# EAGLE design motion_detect (EAGLE 7.7.0)
Assembly variants: AM612, AM312
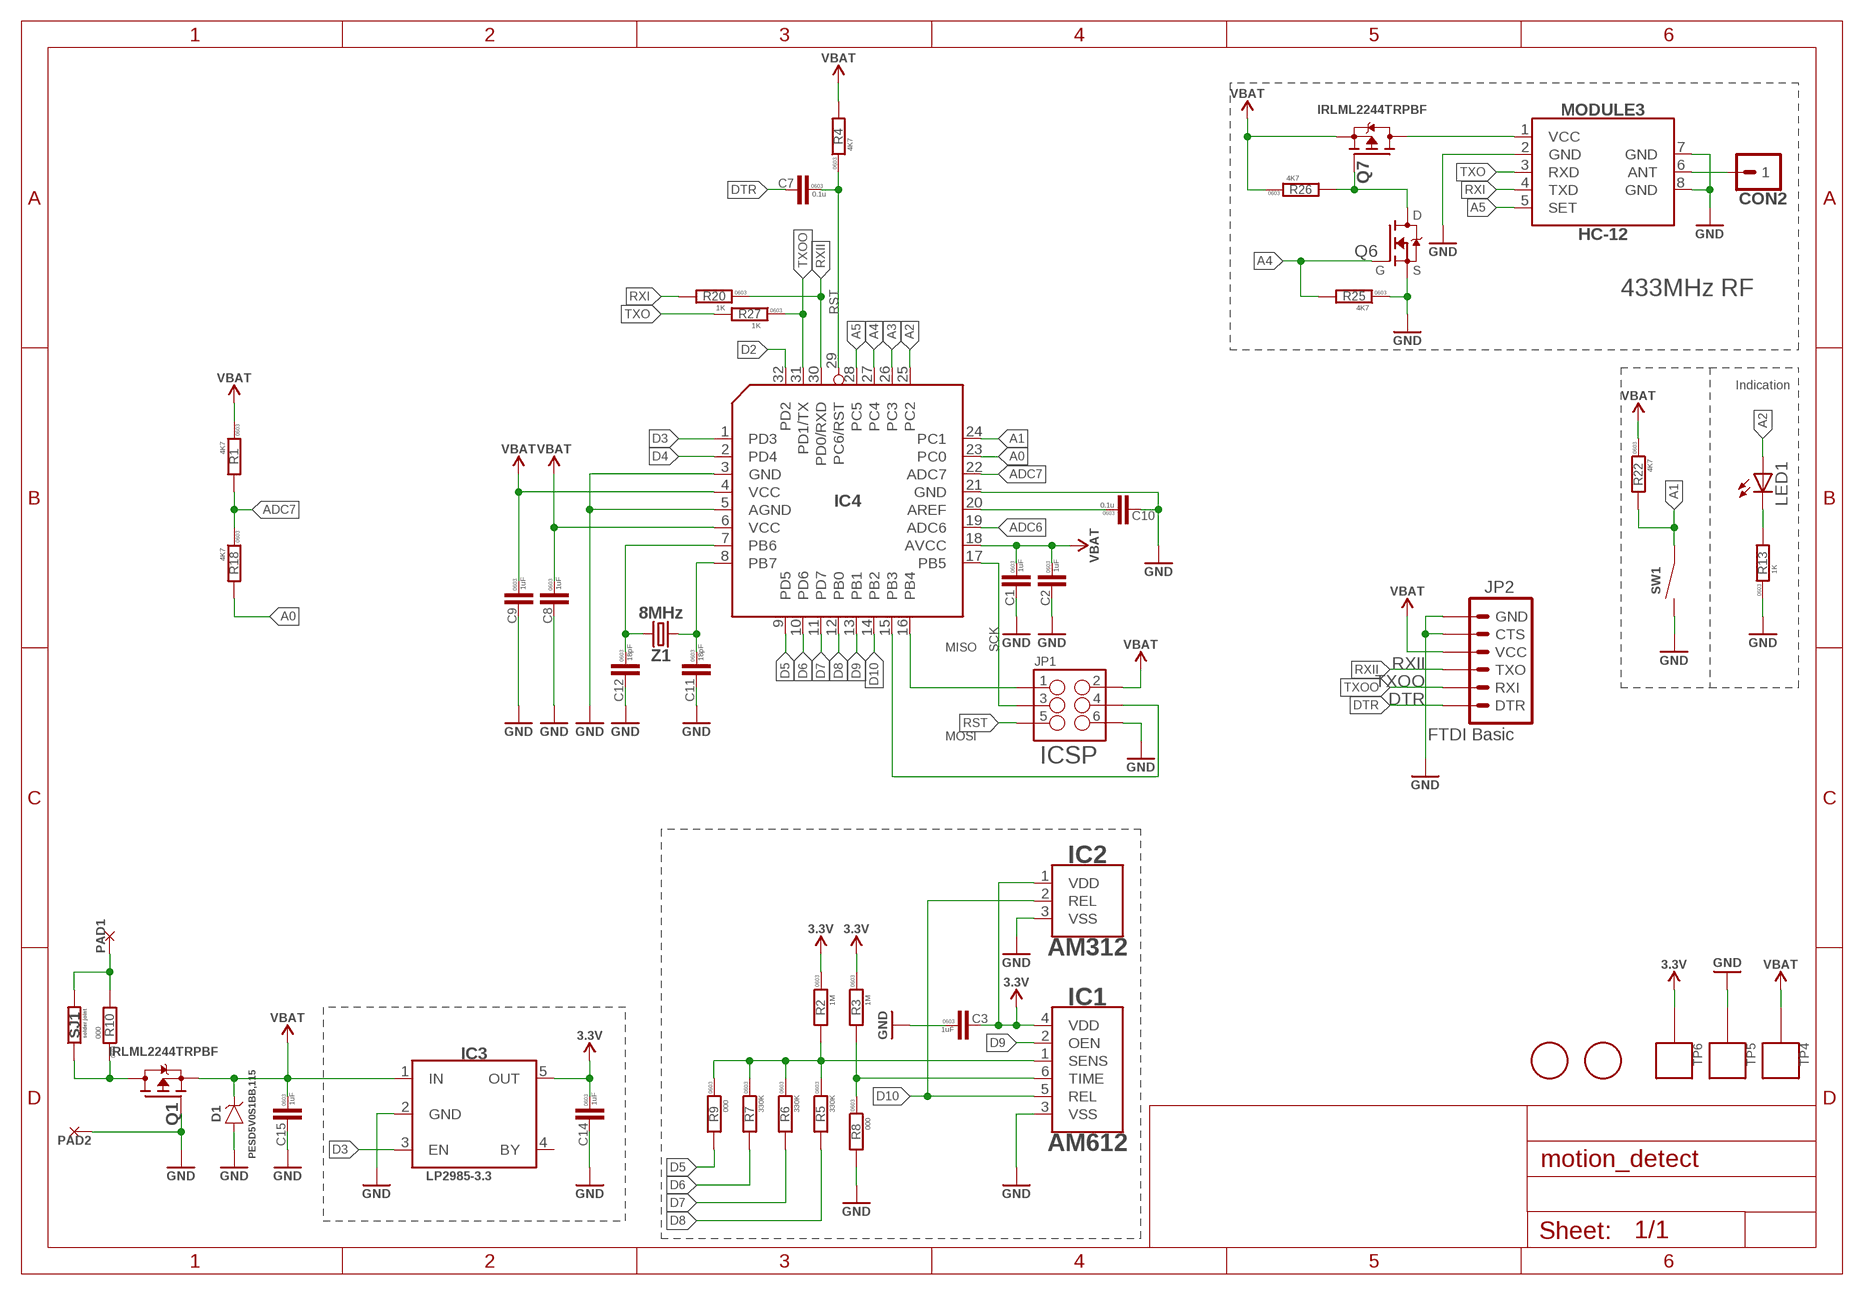
[diagram p0: schematic, sheet 1]

## Parts
C1  1uF  C-0603  [C0603]
C2  1uF  C-0603  [C0603]
C3  1uF  C-0603  [C0603]
C7  0.1u  C-0603  [C0603]
C8  1uF  C-0603  [C0603]
C9  1uF  C-0603  [C0603]
C10  0.1u  C-0603  [C0603]
C11  18pF  C-0603  [C0603]
C12  18pF  C-0603  [C0603]
C14  1uF  C-0603  [C0603]
C15  1uF  C-0603  [C0603]
CON2  PINHEAD_1X01-2.54  [1X01-PTH-2.54]
D1  PESD5V0S1BB,115  [SOD123]
IC1  AM612  [AM612]  (not fitted in variant AM312)
IC2  AM312  [AM312_SIL]  (not fitted in variant AM612)
IC3  3.3  LP2985-3.3V  [SOT23-5L]
IC4  ATMEGA168-TQFP32  [TQFP32-08]
JP1  M03X2POGO_PINS  [2X3_POGO]
JP2  FTDI Basic  ARDUINO_SERIAL_PROGRAMPTH  [1X06]
LED1  LED-3MM  [LED-3MM]
MODULE3  HC12  [HC-12]
PAD1  PAD-4X3  [4X3]
PAD2  PAD-4X3  [4X3]
Q1  IRLML2244TRPBF  [SOT23B-3]
Q6  IRLML2502-SOT23  [SOT23B-3]
Q7  IRLML2244TRPBF  [SOT23B-3]
R1  4K7  R-0603  [R0603]
R2  1M  R-0603  [R0603]
R3  1M  R-0603  [R0603]
R4  4K7  R-0603  [R0603]
R5  330K  R-0603  [R0603]
R6  330K  R-0603  [R0603]
R7  330K  R-0603  [R0603]
R8  000  R-0603  [R0603]
R9  000  R-0603  [R0603]
R10  000  R-0603  [R0603]
R13  1K  R-0603  [R0603]
R18  4K7  R-0603  [R0603]
R20  1K  R-0603  [R0603]
R22  4K7  R-0603  [R0603]
R25  4K7  R-0603  [R0603]
R26  4K7  R-0603  [R0603]
R27  1K  R-0603  [R0603]
SJ1  SOLDER_JOINT_2P  [SJ_2P]
SW1  TACT_SWITCH-IT-1102S  [IT-1102S]
TP4  PAD.05  [PAD.05X.05]  (not fitted in variant AM612)  (not fitted in variant AM312)
TP5  PAD.05  [PAD.05X.05]  (not fitted in variant AM612)  (not fitted in variant AM312)
TP6  PAD.05  [PAD.05X.05]  (not fitted in variant AM612)  (not fitted in variant AM312)
U$4  FIDUCIALMOUNT  [FIDUCIA-MOUNT]  (not fitted in variant AM612)  (not fitted in variant AM312)
U$6  FIDUCIALMOUNT  [FIDUCIA-MOUNT]  (not fitted in variant AM612)  (not fitted in variant AM312)
Z1  8MHz  CRYSTAL-8MHZHC49UP  [HC49UP]

## Nets
A0: IC4.23(PC0) R18.2
A1: IC4.24(PC1) R22.2 SW1.1 SW1.2
A2: IC4.25(PC2) LED1.A
A3: IC4.26(PC3)
A4: IC4.27(PC4) Q6.1(G) R25.2
A5: IC4.28(PC5) MODULE3.5(SET)
ADC6: IC4.19(ADC6)
ADC7: IC4.22(ADC7) R1.2 R18.1
ANT: CON2.1 MODULE3.6(ANT)
D2: IC4.32(PD2)
D3: IC3.3(EN) IC4.1(PD3)
D4: IC4.2(PD4)
D5: IC4.9(PD5) R9.2
D6: IC4.10(PD6) R7.2
D7: IC4.11(PD7) R6.2
D8: IC4.12(PB0) R5.2
D9: IC1.2(OEN) IC4.13(PB1)
D10: IC1.5(REL) IC2.2(REL) IC4.14(PB2)
DTR: C7.2 JP2.1(DTR)
GND: C1.2 C2.2 C3.1 C8.2 C9.2 C10.2 C11.2 C12.2 C14.2 C15.2 D1.A IC1.3(VSS) IC2.3(VSS) IC3.2(GND) IC4.3(GND) IC4.5(AGND) IC4.21(GND) JP1.P$6 JP2.5(CTS) JP2.6(GND) MODULE3.2(GND) MODULE3.7(GND) MODULE3.8(GND) PAD2.P$1 Q1.1(G) Q6.2(S) R8.2 R13.1 R25.1 SW1.3 SW1.4 TP5.P$1
MISO: IC4.16(PB4) JP1.P$1
MOSI: IC4.15(PB3) JP1.P$4
N$1: PAD1.P$1 R10.2 SJ1.2
N$3: IC1.6(TIME) R3.2 R8.1
N$4: C10.1 IC4.20(AREF)
N$5: IC1.1(SENS) R2.2 R5.1 R6.1 R7.1 R9.1
N$6: C12.1 IC4.7(PB6) Z1.2
N$7: Q1.3(D) R10.1 SJ1.1
N$8: C11.1 IC4.8(PB7) Z1.1
N$12: LED1.K(C) R13.2
N$24: MODULE3.1(VCC) Q7.3(D)
N$27: Q6.3(D) Q7.1(G) R26.2
RST: C7.1 IC4.29(PC6/RST) JP1.P$5 R4.1
RXI: MODULE3.4(TXD) R20.2
RXII: IC4.30(PD0/RXD) JP2.3(TXO) R20.1
SCK: IC4.17(PB5) JP1.P$3
TXO: MODULE3.3(RXD) R27.2
TXOO: IC4.31(PD1/TX) JP2.2(RXI) R27.1
VBAT: C1.1 C2.1 C8.1 C9.1 C15.1 D1.C IC3.1(IN) IC4.4(VCC) IC4.6(VCC) IC4.18(AVCC) JP1.P$2 JP2.4(VCC) Q1.2(S) Q7.2(S) R1.1 R4.2 R22.1 R26.1 TP4.P$1
VDD_3V3: C3.2 C14.1 IC1.4(VDD) IC2.1(VDD) IC3.5(OUT) R2.1 R3.1 TP6.P$1 ; supply symbol labelled 3.3V
Unconnected: IC3.4(BY)

## Notes on the sheet
- 433MHz RF
- Indication
- ICSP

## Library data of the parts
C1-C3 C7-C12 C14 C15 = rc:C; PACKAGE: 0603
CON2 = pinhead:PINHEAD_1X01: pinheader 1P; BOM: EXCLUDE
D1 = TVS_diodes:PESD5V0S1BB,115; DIGIKEY#: 1727-3838-2-ND; MANF: Nexperia USA Inc; MANF#: PESD5V0S1BB,115
IC1 = motion_detect_masterlib:AM612
IC2 = motion_detect_masterlib:AM312
IC3 = motion_detect_masterlib:LP2985-3.3V: IC REG LDO 3.3V 0.15A SOT23-5; DIGIKEY#: 296-18476-1-ND; MANF: Texas Instruments; MANF#: LP2985-33DBVR
IC4 = motion_detect_masterlib:ATMEGA168; MANF#: ATMEGA168
JP1 = SparkFun-Connectors:M03X2: 2x3 .1" header. Shrouded, with keying- CONN-10681 SMT- CONN-11415 Pogo pins- HW-11044; PROD_ID: HW-11044
JP2 = SparkFun:ARDUINO_SERIAL_PROGRAM
LED1 = dp_devices:LED: Light Emitting Diode; COLOR: RED
MODULE3 = motion_detect_masterlib:HC12
PAD1 PAD2 = PADS:PAD; BOM: EXCLUDE
Q1 Q7 = motion_detect_masterlib:IRLML2244TRPBF: MOSFET P-CH 20V 4.3A SOT23; DIGIKEY#: IRLML2244TRPBFCT-ND; LINK: https://www.chipdip.ru/product/irlml2244trpbf; MANF: Infineon Technologies; MANF#: IRLML2244TRPBF
Q6 = motion_detect_masterlib:IRLML2502: MOSFET N-CH 20V 4.2A SOT-23; DIGIKEY#: IRLML2502PBFTR-ND; MANF: Infineon Technologies; MANF#: IRLML2502TRPBF
R1-R10 R13 R18 R20 R22 R25-R27 = rc:R; PACKAGE: 0603
SJ1 = misc:SOLDER_JOINT_2P; BOM: EXCLUDE
SW1 = motion_detect_masterlib:TACT_SWITCH; LINK: https://www.chipdip.ru/product/kls7-ts6604-4.3-180-b-it-1102s
TP4-TP6 = pixhawk2:PAD: Test pad This footprint includes three classes: The actual test pads, a pogo-pin footprint to mount the pogo-pin as through-hole part and a hole footprint which allows the head of the pogo-pin to pass through (do NOT use the hole to mount the pogo-pin). In a typical test setup, the stack would consist of three PCBs: The actual PCB under testing with a test pad on the bottom, then a second PCB with the hole for the pogo-pin head where the PCB under testing is pressed on and a third PCB at 30 mm / 1.2" distance with the pogo-pin footprints. The pogo-pins are soldered to the last PCB. To create the stack, copy the board under testing and exchange the footprints - this way the correct positioning is ensured.; BOM: EXCLUDE; PARTNO: *
U$4 U$6 = eth_conv_master_lib:FIDUCIALMOUNT; BOM: EXCLUDE
Z1 = ExitControl_v2_master_library:CRYSTAL-8MHZ: Crystal 8.0000MHz 30ppm 18pF 40 Ohm -20°C - 70°C Surface Mount HC49/US; DIGIKEY#: 535-10212-1-ND; MANF: Abracon LLC; MANF#: ABLS-8.000MHZ-B4-T

## Net classes
0 default: width 0.2 mm
1 vcc: width 0.254 mm

## Board
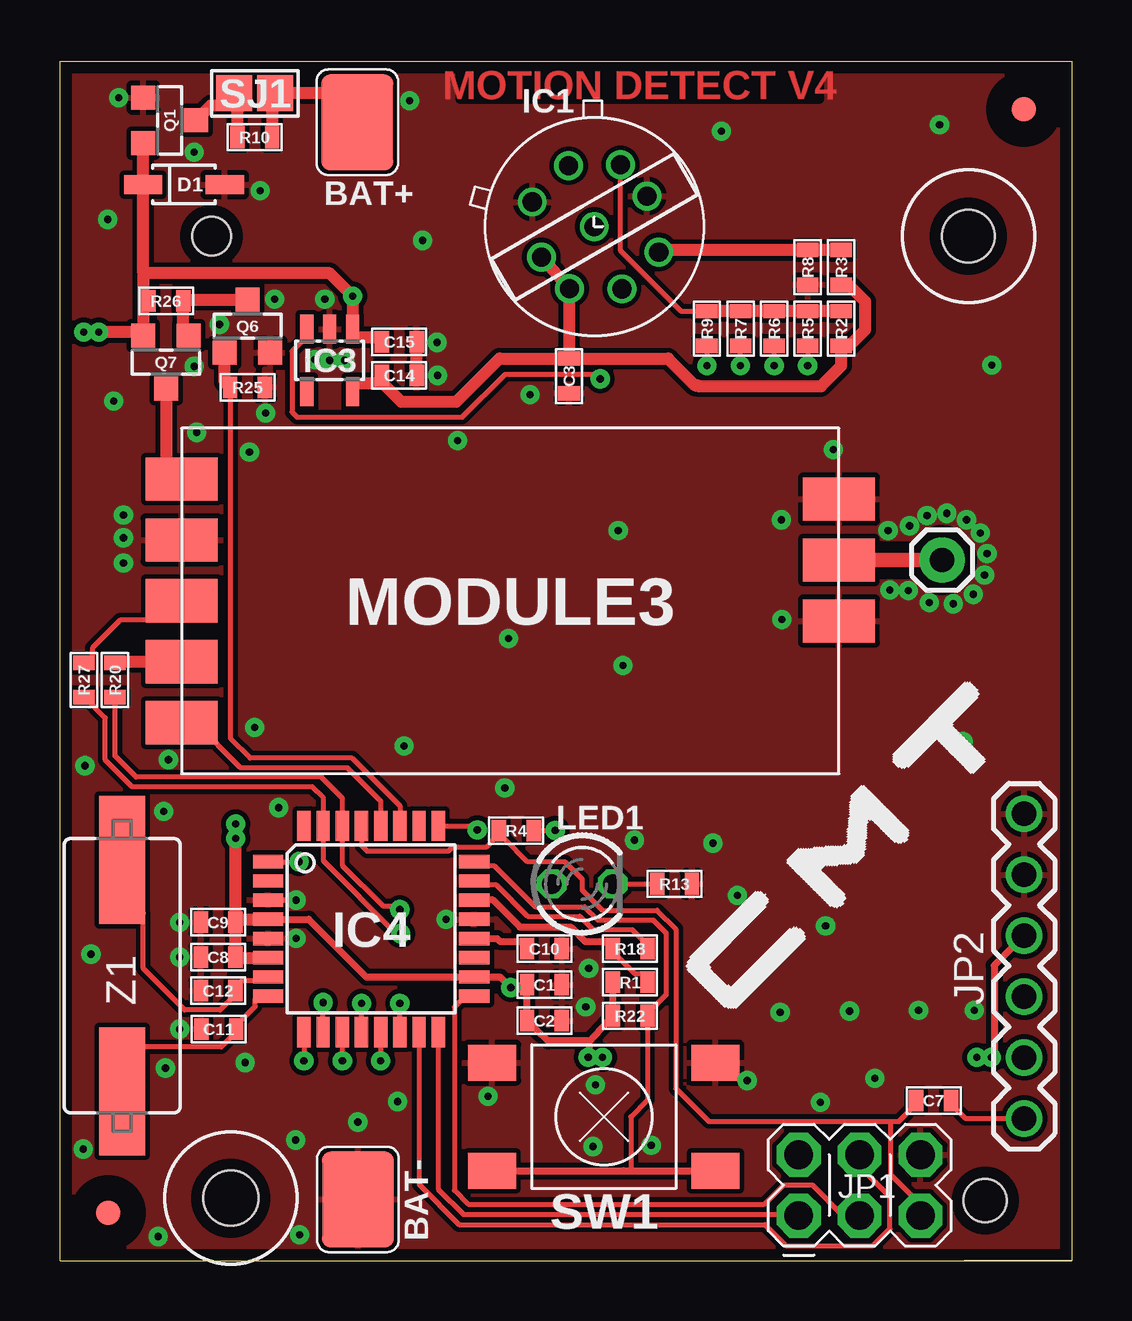
[diagram p1: board, top side]
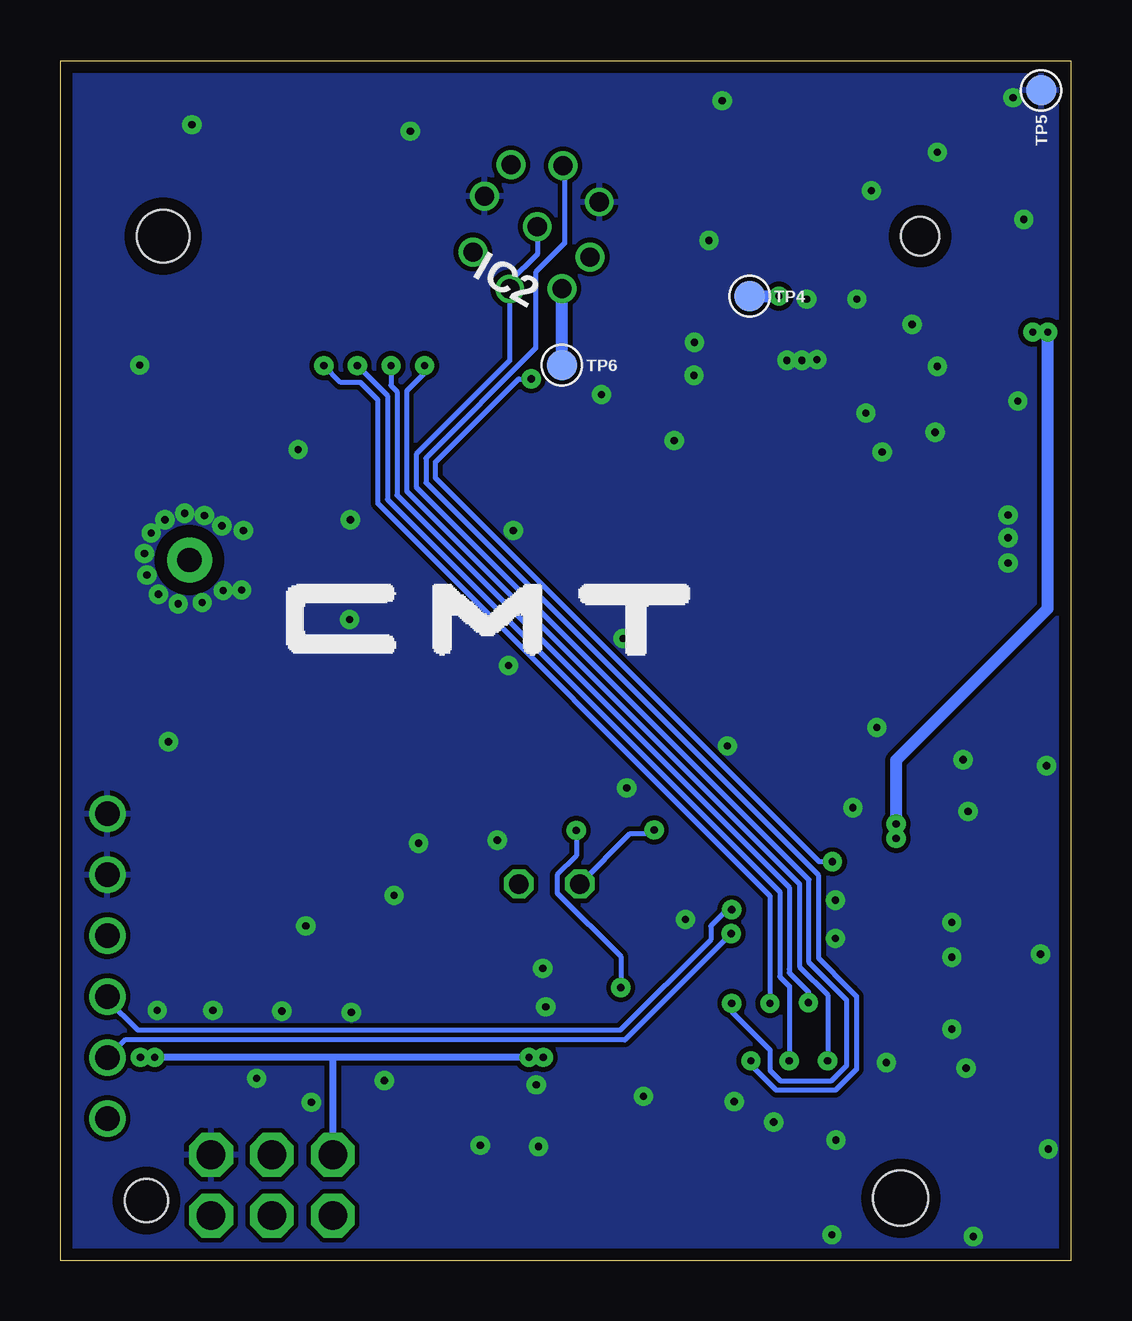
[diagram p2: board, bottom side, seen from below]

Size 42.15 x 50 mm. Coordinates in mm from the lower left corner, seen from the top.
Copper layers (1*2*15*16): Top 0.035mm / dielectric 0.5mm / Route2 0.035mm / dielectric 0.5mm / Route15 0.035mm / dielectric 0.5mm / Bottom 0.035mm
Design rules "RTK_design_rules *": minimum track width 0.15mm, minimum drill 0.2mm, track to track 0.2mm, track to pad 0.2mm, pad to pad 0.2mm, via to via 0.2mm, smd to smd 0.15mm, copper to edge 0.5mm, drill to drill 0.2mm, minimum pad ring 0.125mm, minimum via ring 0.125mm, stop-mask expansion 1mil, vias tented up to drill 0.31mm, thermal gap 8mil
tRestrict: area 35.5,28 to 38,30.4; 2 lines
bRestrict: area 35.5,28 to 38,30.4

### Footprints (pad centres in the part's own frame; a part is rotated, then mirrored left to right if it is on the bottom)
C0603 = smd 0.6 x 0.9: 1 -0.725,0; 2 0.725,0
1X01-PTH-2.54 = drill 1.016 pad 1.88: 1 0,0
SOD123 = smd 1.6 x 0.8: A -1.7,0; C 1.7,0
AM612 = drill 0.8: 1 1.05,2.6; 2 2.55,1.04; 3 2.55,-1.1; 4 -1.1,-2.55; 5 -2.65,-1.02; 6 -2.65,1.15
AM312_SIL = drill 0.8: 1 2.54,0; 2 0,0; 3 -2.54,0
SOT23-5L = smd 0.55 x 1.2: 1 -0.95,-1.3; 2 0,-1.3; 3 0.95,-1.3; 4 0.95,1.3; 5 -0.95,1.3
TQFP32-08 = smd 1.27 x 0.559: 1 -4.293,2.8; 2 -4.293,2; 3 -4.293,1.2; 4 -4.293,0.4; 5 -4.293,-0.4; 6 -4.293,-1.2; 7 -4.293,-2; 8 -4.293,-2.8; 17 4.293,-2.8; 18 4.293,-2; 19 4.293,-1.2; 20 4.293,-0.4; 21 4.293,0.4; 22 4.293,1.2; 23 4.293,2; 24 4.293,2.8 | smd 0.559 x 1.27: 9 -2.8,-4.293; 10 -2,-4.293; 11 -1.2,-4.293; 12 -0.4,-4.293; 13 0.4,-4.293; 14 1.2,-4.293; 15 2,-4.293; 16 2.8,-4.293; 25 2.8,4.293; 26 2,4.293; 27 1.2,4.293; 28 0.4,4.293; 29 -0.4,4.293; 30 -1.2,4.293; 31 -2,4.293; 32 -2.8,4.293
2X3_POGO = drill 1.2 pad 1.829 octagon: P$1 0,0; P$2 0,2.54; P$3 2.54,0; P$4 2.54,2.54; P$5 5.08,0; P$6 5.08,2.54
1X06 = drill 1.016: 1 0,0; 2 2.54,0; 3 5.08,0; 4 7.62,0; 5 10.16,0; 6 12.7,0
LED-3MM = drill 0.813 octagon: A -1.27,0; K 1.27,0
HC-12 = smd 3 x 1.8: 1 -13.7,5.08; 2 -13.7,2.54; 3 -13.7,0; 4 -13.7,-2.54; 5 -13.7,-5.08; 6 13.7,1.7; 7 13.7,4.24; 8 13.7,-0.84
4X3 = smd 4 x 3: P$1 0,0
SOT23B-3 = smd 1 x 1: 1 -0.95,-1.1; 2 0.95,-1.1; 3 0,1.1
R0603 = smd 0.6 x 0.9: 1 -0.725,0; 2 0.725,0
SJ_2P = smd 1.5 x 1.5: 1 -0.85,0; 2 0.85,0
IT-1102S = smd 2 x 1.5: 1 -4.65,2.25; 2 4.65,2.25; 3 -4.65,-2.25; 4 4.65,-2.25
PAD.05X.05 = smd 1.27 x 1.27: P$1 0,0
REDMOND_BOARD = hole 2.2: 37.85,42.7 | hole 2.3: 7.1,2.6 | hole 1.8: 38.55,2.5 | hole 1.6: 6.3,42.7
FIDUCIA-MOUNT = smd 1.016 x 1.016: P$1 0,0
HC49UP = smd 5.334 x 1.93: 1 -4.826,0; 2 4.826,0

### Placement (x,y rotation side)
C1  20.18,11.5 0 top
C2  20.18,10 0 top
C3  21.2,36.88 90 top
C7  36.4,6.67 0 top
C8  6.58,12.65 180 top
C9  6.58,14.1 180 top
C10  20.18,13 0 top
C11  6.6,9.65 180 top
C12  6.58,11.25 180 top
C14  14.12,36.9 0 top
C15  14.12,38.3 0 top
CON2  36.75,29.2 0 top
D1  5.15,44.85 180 top
IC1  22.25,43.1 45 bottom
IC2  22.25,43.1 330 bottom
IC3  11.22,37.52 180 top
IC4  12.95,13.82 0 top
JP1  30.77,1.88 0 top
JP2  40.17,5.92 90 top
LED1  21.75,15.7 0 top
MODULE3  18.75,27.5 0 top
PAD1  12.38,47.45 90 top
PAD2  12.4,2.55 90 top
Q1  4.55,47.52 270 top
Q6  7.8,38.95 0 top
Q7  4.4,37.45 180 top
R1  23.75,11.6 0 top
R2  32.55,38.85 90 top
R3  32.55,41.4 90 top
R4  19,17.93 0 top
R5  31.15,38.85 270 top
R6  29.75,38.85 270 top
R7  28.35,38.85 270 top
R8  31.15,41.4 270 top
R9  26.95,38.85 270 top
R10  8.1,46.83 0 top
R13  25.6,15.7 180 top
R18  23.75,13 0 top
R20  2.27,24.2 90 top
R22  23.75,10.2 0 top
R25  7.8,36.4 180 top
R26  4.4,40 0 top
R27  0.97,24.2 90 top
SJ1  8.1,48.65 0 top
SW1  22.65,6 180 top
TP4  13.4,40.2 0 bottom
TP5  1.25,48.77 270 bottom
TP6  21.23,37.33 0 bottom
U$1  [SMT_LOGO]  28,10.18 45 top
U$2  [REDMOND_BOARD]  0,0 0 top
U$3  [SMT_LOGO]  32.76,25.19 0 bottom
U$4  40.15,48 0 top
U$6  2,2 0 top
Z1  2.58,11.88 90 top

### Tracks (layer width: path | path; a pad name or v marks a point on that pad's centre or on a via)
A0
  Top 0.2: IC4.23 17.4,15.82 17.57,15.65 18.18,15.65 19.48,14.35 21.65,14.35 22.2,13.8 23.82,13.8 24.48,13.15 R18.2
A1
  Top 0.2: 23.48,3.75 23.48,3.7 | IC4.24 17.4,16.62 17.57,16.45 18.1,16.45 19.8,14.75 21.85,14.75 22.4,14.2 24.71,14.2 25.25,13.66 25.25,11.07 24.66,10.49 24.64,10.49 24.48,10.32 R22.2 24.48,6.7 23.77,6 23.77,3.75
  Top 0.3: 17.8,3.75 SW1.2 23.48,3.75 23.77,3.75 SW1.1 27.5,3.75
A2  (via drill 0.3 pad 0.8)
  Top 0.2: 15.75,17.85 IC4.25 17.38,18.12 v17.38,17.95
  Bottom 0.2: LED1.A 18.38,17.8 17.38,17.8 v17.38,17.95
A4
  Top 0.2: R25.2 7.1,36.4 7.1,21.75 7.9,20.95 12.15,20.95 14.15,18.95 IC4.27
  Top 0.5: R25.2 6.85,36.62 Q6.1
A5
  Top 0.2: MODULE3.5 5.63,22.42 7.5,20.55 11.95,20.55 13.35,19.15 IC4.28
ADC7
  Top 0.2: R18.1 23.02,12.88 23.95,11.95 24.27,11.95 24.48,11.75 R1.2
  Top 0.3: R18.1 23.02,13.15 23,13.15 22.85,13.3 21.88,13.3 21.27,13.9 19.15,13.9 18.02,15.03 IC4.22
ANT
  Top 0.6: MODULE3.6 CON2.1
D3  (via drill 0.3 pad 0.8)
  Top 0.2: IC4.1 v9.95,16.62 | IC3.3 10.28,38.52 9.65,37.9 9.65,35.38 9.88,35.15 16.75,35.15 18.55,36.95 22.3,36.95 v22.5,36.75
  Bottom 0.2: v9.95,16.62 10.5,16.62 26.5,32.62 26.5,33.28 23.03,36.75 v22.5,36.75
D5  (via drill 0.3 pad 0.8)
  Top 0.2: IC4.9 v10.15,8.32 | R9.2 v26.95,37.3
  Bottom 0.2: v26.95,37.3 26.95,37 27.7,36.25 27.7,32.08 11.32,15.7 11.32,12.25 10.15,11.07 v10.15,8.32
D6  (via drill 0.3 pad 0.8)
  Top 0.2: IC4.10 v10.95,10.75 | v28.35,37.3 R7.2
  Bottom 0.2: v28.35,37.3 28.35,36.48 28.1,36.23 28.1,31.9 11.75,15.55 11.75,12.15 11.75,12 10.95,11.2 v10.95,10.75
D7  (via drill 0.3 pad 0.8)
  Top 0.2: IC4.11 v11.75,8.32 | R6.2 v29.75,37.3
  Bottom 0.2: v29.75,37.3 28.5,36.05 28.5,31.73 12.15,15.38 12.15,11.83 11.72,11.41 11.72,8.38 11.75,8.35 v11.75,8.32
D8  (via drill 0.3 pad 0.8)
  Top 0.2: IC4.12 v12.55,10.72 | R5.2 v31.15,37.3
  Bottom 0.2: v12.55,10.72 12.55,15.2 28.9,31.55 28.9,35.88 29.62,36.6 30.45,36.6 v31.15,37.3
D9  (via drill 0.3 pad 0.8)
  Top 0.2: IC4.13 v13.35,8.32
  Bottom 0.2: 9.15,11.22 9.24,11.31 | 9.24,11.31 10.53,12.6 10.53,16.05 26.9,32.42 26.9,33.45 22.32,38.02 22.32,41.2 21.1,42.42 21.1,45.56 IC1.2 | 9.24,11.31 9.24,11.3 8.95,11.02 8.95,7.97 9.82,7.1 12.29,7.1 13.35,8.16 v13.35,8.32
D10  (via drill 0.3 pad 0.8)
  Top 0.2: IC4.14 v14.15,10.72
  Bottom 0.2: v14.15,10.72 14.15,10.38 12.55,8.78 12.55,7.92 12.12,7.5 9.98,7.5 9.35,8.13 9.35,10.85 10.93,12.43 10.93,15.88 27.3,32.25 27.3,33.62 23.4,37.51 IC1.5 23.4,40.8 22.25,41.95 IC2.2
DTR
  Top 0.2: JP2.1 37.73,5.92 37.12,6.53 C7.2
GND  (via drill 0.3 pad 0.8)
  Top 0.2: IC4.3 v9.82,15.03
  Top 0.5: C14.2 C15.2 14.88,38.27
  other vias: 9.82,13.43 16.07,14.22 4.97,12.65 4.97,9.65 4.97,14.1 11.22,37.52 8.55,35.33 15.7,38.27 17.82,6.85 2.42,48.48 28.23,15.22 10.6,37.55 11.03,40.08 11.85,37.52 15.72,36.9 2.62,31.07 2.62,30.12 2.62,29.07 8.93,40.08 6.62,39.02 5.58,37.27 5.67,34.52 2.23,35.83 9.1,18.88 4.3,18.73 1.02,20.62 4.5,20.88 34.58,27.95 35.35,27.93 36.23,27.43 37.23,27.38 38.05,27.77 38.52,28.57 38.62,29.48 38.35,30.32 37.77,30.88 36.95,31.15 36.12,31.05 35.4,30.62 34.5,30.43 22.3,7.33 22.2,4.75 24.62,4.8 28.62,7.5 31.68,6.6 33.95,7.6 38.1,10.43 35.77,10.43 32.9,10.4 30,10.35 31.9,13.95 27.2,17.4 23.93,17.52 18.52,19.7 37.62,21.62 23.45,24.8 30.07,26.73 30.05,30.88 32.23,33.8 1.98,43.4 5.58,46.2 15.1,42.52 14.32,21.45 18.68,25.93 23.25,30.43 7.88,33.7 8.1,22.23 16.55,34.17 19.57,36.1 14.55,48.35 27.55,47.08 1.27,12.78 0.95,4.65 4.38,8.03 9.8,5.03 7.7,8.25 4.08,1 36.65,47.35 38.83,37.33 8.32,44.6 12.4,5.78 14.05,6.62 9.97,1.07 21.9,10.57 22.02,12.18
  pour Bottom: 0,50 42.15,50 42.15,0 0,0
  pour Top: 0,50 42.15,50 42.15,0 0,0
MISO
  Top 0.2: IC4.16 15.75,2.98 16.8,1.93 30.77,1.93 JP1.P$1
MOSI
  Top 0.2: IC4.15 14.95,3.17 16.62,1.5 29.38,1.5 30.25,0.62 33.88,0.62 34.58,1.32 34.58,2.65 33.31,3.91 JP1.P$4
N$1
  Top 0.406: 12.3,47.52 12.3,47.58
  Top 0.5: PAD1.P$1 arc90 11.18,48.65 SJ1.2 arc90 8.82,48.52 R10.2
  Top 0.8: 12,47.52 12.12,47.4 12.3,47.58 | 12.3,47.58 12.25,47.62 | PAD1.P$1 12.38,47.5 12.3,47.58
N$3
  Top 0.5: R3.2 R8.1 25.02,42.12 IC1.6
N$4
  Top 0.3: 19.45,12.7 C10.1 19.45,13.3 18.32,13.3 18.2,13.43 IC4.20
N$5
  Top 0.2: IC1.1 23.35,42.1 25.88,39.58 27.05,39.58
  Top 0.5: R9.1 27.05,39.58 R7.1 R6.1 29.7,39.52 29.62,39.52 29.65,39.55 29.93,39.55 29.95,39.58 R5.1 R2.2
N$6
  Top 0.2: Z1.2 2.67,16.7 2.7,16.68 2.7,15.22 3.45,14.47 3.45,12.18 5.17,10.45 6.65,10.45 7.33,11.12 C12.1 | 7.33,11.15 C12.1 | IC4.7 8.48,11.65 7.55,11.65 7.45,11.55 7.45,11.4 C12.1
N$7
  Top 0.5: SJ1.1 arc-90 7.38,48.52 | 7.38,48.52 R10.1 | Q1.3 6.28,48.15 7.15,48.15 7.22,48.23 7.22,48.38 7.38,48.52
N$8
  Top 0.2: 2.58,9.05 2.58,8.9 | 2.58,8.9 Z1.1 | 2.58,8.9 6.7,8.9 7.33,9.53 C11.1 7.33,9.8 8.12,10.6 8.12,10.9 8.25,11.03 IC4.8
N$12
  Top 0.2: LED1.K R13.2
N$24
  Top 0.5: Q7.3 4.4,32.58 MODULE3.1
N$27
  Top 0.5: Q7.1 5.12,38.77 R26.2 5.17,40.05 Q6.3
RST
  Top 0.2: R4.1 18.27,17.73 | 18.27,17.73 18.25,17.7 18.23,17.7 17.77,17.25 16.35,17.25 16.18,17.07 12.78,17.07 12.55,17.3 IC4.29 | 18.27,17.73 18.32,17.73 18.48,17.57 18.52,17.57 19.48,16.62 21.02,16.62 21.75,15.9 21.75,15.45 22.6,14.6 24.88,14.6 25.65,13.82 25.65,7.17 27.02,5.8 34.62,5.8 | 34.62,5.8 34.95,5.8 35.67,6.53 C7.1 | JP1.P$5 35.85,2.35 34.62,3.58 34.62,5.8
RXI
  Top 0.5: MODULE3.4 2.54,24.96 R20.2
RXII  (via drill 0.3 pad 0.8)
  Top 0.2: v14.15,14.62 14,14.78 13.45,14.78 11.75,16.48 IC4.30 11.75,19.27 10.88,20.15 3.15,20.15 2.27,21.02 R20.1
  Bottom 0.2: JP2.3 40.17,10.88 38.9,9.6 18.8,9.6 15.03,13.38 15.03,13.95 14.35,14.62 v14.15,14.62
SCK
  Top 0.2: 17.23,11.03 IC4.17 16.7,11.03 16.7,10.85 16.43,10.57 16.43,2.92 17,2.35 29.35,2.35 30.15,3.15 31.35,3.15 32.62,1.88 JP1.P$3
TXO
  Top 0.2: MODULE3.3 4.25,26.7 2.5,26.7 1.32,25.52 1.32,24.93 R27.2
TXOO  (via drill 0.3 pad 0.8)
  Top 0.2: R27.1 1.02,23.48 1.88,22.62 1.88,20.86 2.98,19.75 10.5,19.75 10.95,19.3 IC4.31 10.95,16.68 14,13.62 v14.18,13.62
  Bottom 0.2: v14.18,13.62 18.6,9.2 39.44,9.2 JP2.2
VBAT  (via drill 0.3 pad 0.8)
  Top 0.2: R4.2 v20.62,17.93
  Top 0.3: 8.56,14.12 IC4.4 10.35,14.22 12.75,11.82 IC4.18 18.32,11.82 v18.77,11.38 19.43,11.38 19.45,11.4 | R1.1 R22.1 22.02,9.12 | v22.6,8.47 v22,8.47 22.02,8.5 22.02,9.12 | 22.02,9.12 22,9.15 20.32,9.15 C2.1 19.45,11.4 | JP2.4 38.92,12.29 38.92,8.6 v38.8,8.47 v38.2,8.47 | 19.45,11.4 C1.1 | 7.3,12.53 C8.1
  Top 0.5: 3.45,41.15 3.45,39.95 | 3.45,39.95 3.45,38.7 | 3.45,38.7 3.65,38.5 3.58,38.5 3.55,38.48 3.52,38.48 Q7.2 | R26.1 3.5,40 3.45,39.95 | 3.45,41.15 11.22,41.15 v12.18,40.2 IC3.1 12.18,38.5 13.4,38.5 C15.1 | C8.1 C9.1 | C9.1 v7.3,17.6 v7.3,18.2 | 3.45,38.7 v0.97,38.7 | C9.1 7.42,14.22 IC4.4 | 7.3,12.53 7.4,12.62 IC4.6 | 3.45,41.15 D1.C Q1.2
  Bottom 0.2: v20.62,17.93 20.62,16.88 21.43,16.07 21.43,15.32 18.77,12.68 v18.77,11.38
  Bottom 0.3: v22,8.47 30.75,8.47 | 30.75,8.47 v38.2,8.47 v38.8,8.47 | JP1.P$2 30.77,8.45 30.75,8.47
  Bottom 0.5: TP4.P$1 v12.18,40.2 | v1.6,38.7 v0.97,38.7 0.97,27.18 7.3,20.85 v7.3,17.6
VDD_3V3
  Top 0.5: C14.1 13.4,36.6 | 13.4,36.6 14.2,35.8 16.51,35.8 18.31,37.6 C3.2 | IC3.5 12.18,36.58 13.25,36.58 13.25,36.6 13.4,36.6 | C3.2 21.2,40.49 IC1.4 IC2.1 | C3.2 25.32,37.6 26.45,36.48 26.57,36.48 26.6,36.45 31.7,36.45 32.55,37.3 R2.1 32.88,38.12 33.55,38.8 33.55,39.98 32.85,40.67 R3.1
  Bottom 0.5: TP6.P$1 IC1.4 | IC1.4

### Text on the board
Top: MOTION DETECT V4
tPlace: IC1 | BAT+ | BAT-